# EAGLE schematic design1 (EAGLE 9.5.1)

## Sheet 1 of 2
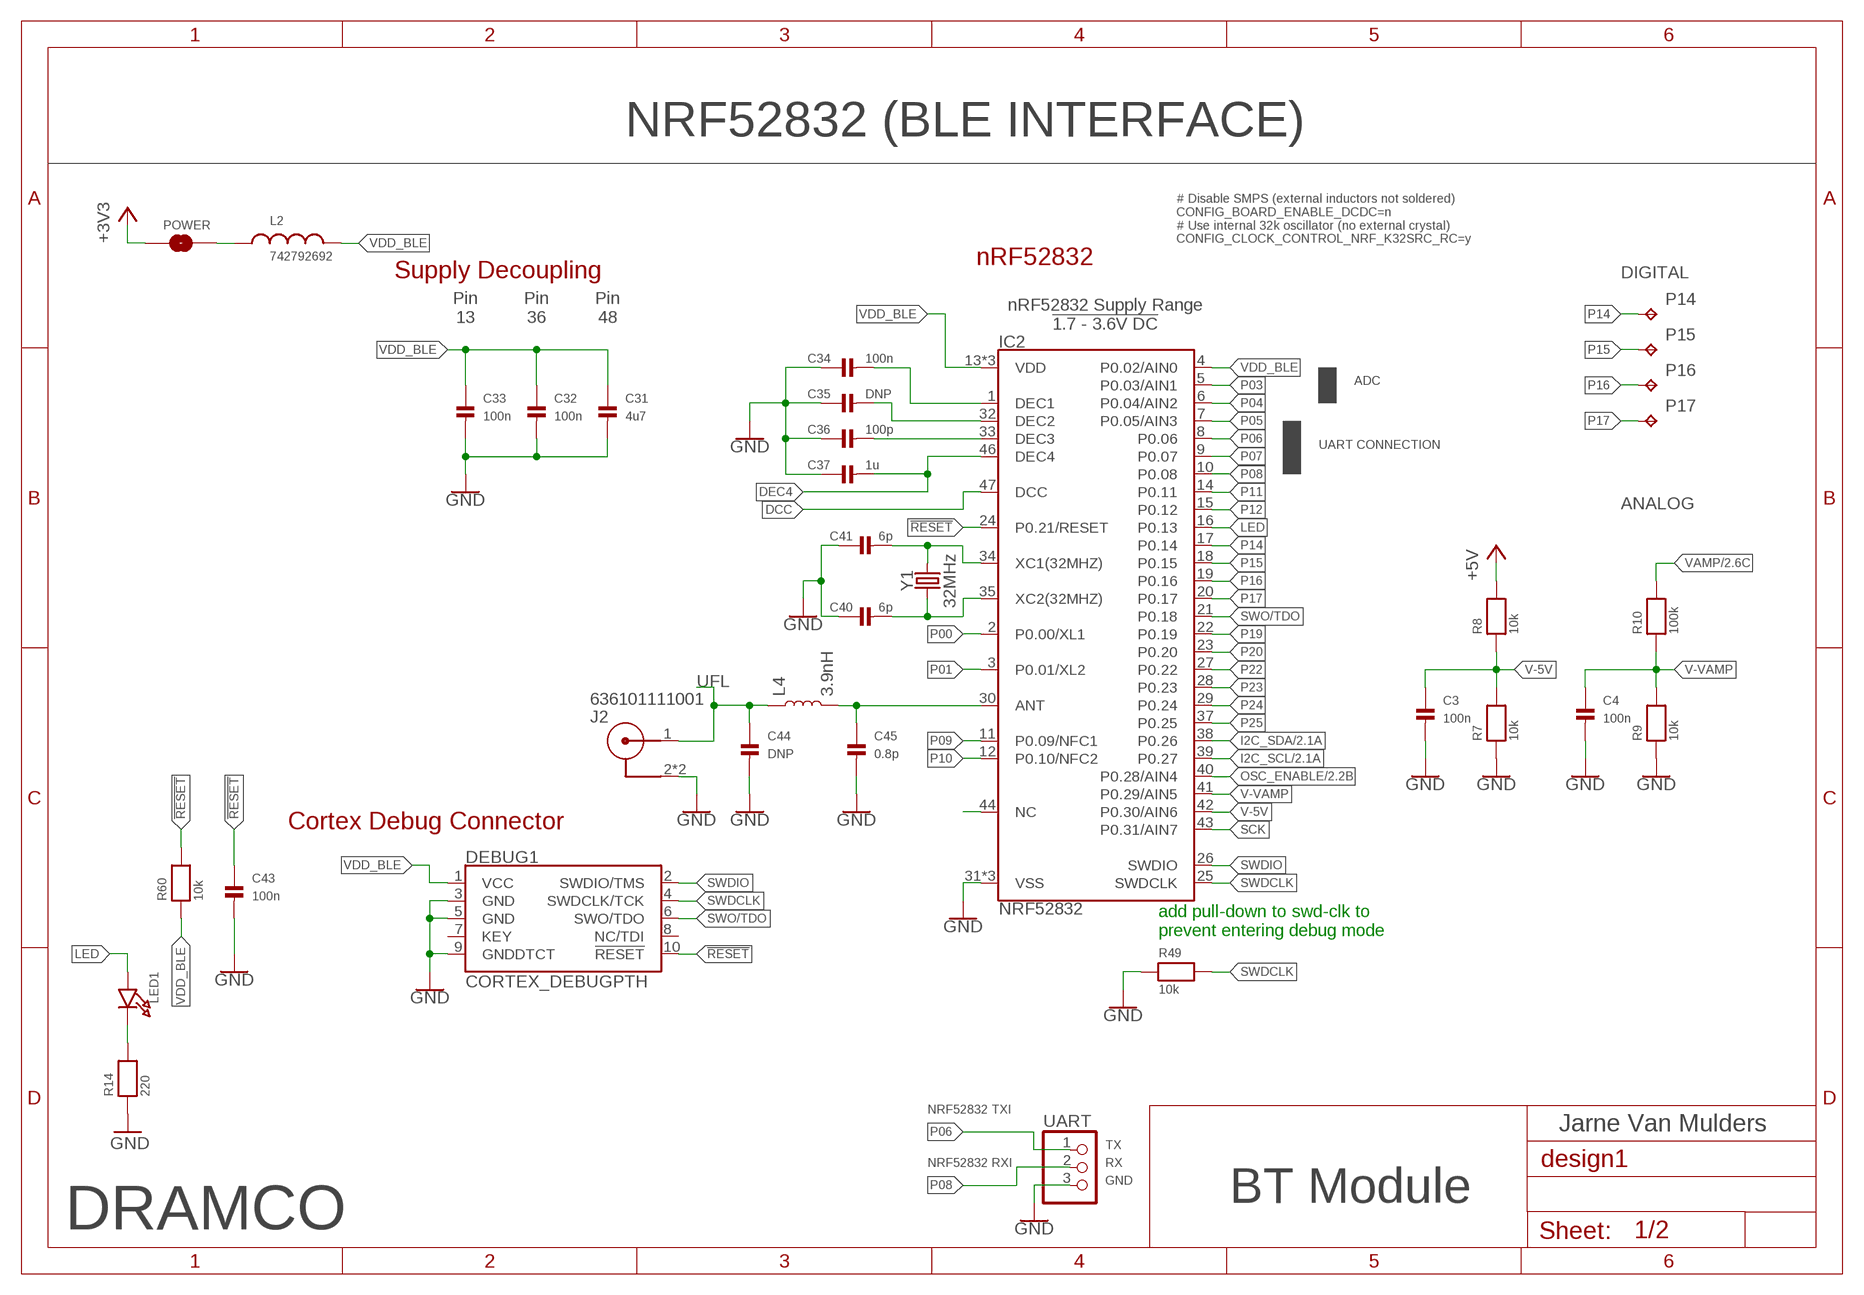
[diagram p0: schematic, sheet 1]

### Parts
C3  100n  CAP_CERAMIC0402  [0402]
C4  100n  CAP_CERAMIC0402  [0402]
C31  4u7  CAP_CERAMIC0603  [0603]
C32  100n  CAP_CERAMIC0402  [0402]
C33  100n  CAP_CERAMIC0402  [0402]
C34  100n  CAP_CERAMIC0402  [0402]
C35  DNP  CAP_CERAMIC0402  [0402]
C36  100p  CAP_CERAMIC0402  [0402]
C37  1u  CAP_CERAMIC0402  [0402]
C40  6p  CAP_CERAMIC0402  [0402]
C41  6p  CAP_CERAMIC0402  [0402]
C43  100n  CAP_CERAMIC0402  [0402]
C44  DNP  CAP_CERAMIC0402  [0402]
C45  0.8p  CAP_CERAMIC0402  [0402]
DEBUG1  CORTEX_DEBUGPTH  [2X5-PTH-1.27MM]
IC2  NRF52832  NRF52832-EXTENDED  [QFN48-6X6MM-EXTENDED]
J2  636101111001  [636101111001]
L2  742792692  WE-CBF_0603_742792692_WB_HS  [WE-CBF_0603(W=2.2)]
L4  3.9nH  INDUCTOR-0402-3.9NH  [0402]
LED1  LED0805  [CHIPLED_0805]
P14  TPTP10SQ  [TP10SQ]
P15  TPTP10SQ  [TP10SQ]
P16  TPTP10SQ  [TP10SQ]
P17  TPTP10SQ  [TP10SQ]
POWER  JUMPER-SMT_2_NO_NO-SILK  [SMT-JUMPER_2_NO_NO-SILK]
R7  10k  RESISTOR0402  [0402]
R8  10k  RESISTOR0402  [0402]
R9  10k  RESISTOR0402  [0402]
R10  100k  RESISTOR0402  [0402]
R14  220  RESISTOR0603  [0603]
R49  10k  RESISTOR0402  [0402]
R60  10k  RESISTOR0402  [0402]
UART  HEADER-1X3ROUND  [1X03_ROUND]
Y1  32MHz  CRYSTAL-32MHZ-SMD-2.0X1.6MM  [CRYSTAL-SMD-2.0X1.6MM]

### Nets
!RESET!: C43.1 DEBUG1.10(!RESET) IC2.24(P0.21/RESET) R60.2
+3V3: POWER.1 ; also sheet 2
+5V: R8.2 ; also sheet 2
ANT: C45.1 IC2.30(ANT) L4.2
DCC: IC2.47(DCC)
DEC4: C37.2 IC2.46(DEC4)
DEC5: C34.2 IC2.1(DEC1)
DEC6: C35.2 IC2.32(DEC2)
DEC8: C36.2 IC2.33(DEC3)
GND: C3.2 C4.2 C31.2 C32.2 C33.2 C34.1 C35.1 C36.1 C37.1 C40.1 C41.1 C43.2 C44.2 C45.2 DEBUG1.3(GND) DEBUG1.5(GND) DEBUG1.9(GNDDTCT) IC2.31(VSS) IC2.45(VSS) IC2.EP(VSS) J2.2 J2.3 R7.1 R9.1 R14.1 R49.1 UART.3 ; also sheet 2
I2C_SCL: IC2.39(P0.27) ; also sheet 2
I2C_SDA: IC2.38(P0.26) ; also sheet 2
LED: IC2.16(P0.13) LED1.A
N$5: LED1.C R14.2
N$14: L2.1 POWER.2
NC: IC2.44(NC)
OSC_ENABLE: IC2.40(P0.28/AIN4) ; also sheet 2
P00: IC2.2(P0.00/XL1)
P01: IC2.3(P0.01/XL2)
P03: IC2.5(P0.03/AIN1)
P04: IC2.6(P0.04/AIN2)
P05: IC2.7(P0.05/AIN3)
P06: IC2.8(P0.06) UART.1
P07: IC2.9(P0.07)
P08: IC2.10(P0.08) UART.2
P09: IC2.11(P0.09/NFC1)
P10: IC2.12(P0.10/NFC2)
P11: IC2.14(P0.11)
P12: IC2.15(P0.12)
P14: IC2.17(P0.14) P14.TP
P15: IC2.18(P0.15) P15.TP
P16: IC2.19(P0.16) P16.TP
P17: IC2.20(P0.17) P17.TP
P19: IC2.22(P0.19)
P20: IC2.23(P0.20)
P22: IC2.27(P0.22)
P23: IC2.28(P0.23)
P24: IC2.29(P0.24)
P25: IC2.37(P0.25)
SCK: IC2.43(P0.31/AIN7)
SWDCLK: DEBUG1.4(SWDCLK/TCK) IC2.25(SWDCLK) R49.2
SWDIO: DEBUG1.2(SWDIO/TMS) IC2.26(SWDIO)
SWO/TDO: DEBUG1.6(SWO/TDO) IC2.21(P0.18)
UFL: C44.1 J2.1 L4.1
V-5V: C3.1 IC2.42(P0.30/AIN6) R7.2 R8.1
V-VAMP: C4.1 IC2.41(P0.29/AIN5) R9.2 R10.1
VAMP: R10.2 ; also sheet 2
VDD_BLE: C31.1 C32.1 C33.1 DEBUG1.1(VCC) IC2.4(P0.02/AIN0) IC2.13(VDD) IC2.36(VDD) IC2.48(VDD) L2.2 R60.1
XC1: C41.2 IC2.34(XC1(32MHZ)) Y1.3
XC2: C40.2 IC2.35(XC2(32MHZ)) Y1.1
Unconnected: DEBUG1.7(KEY) DEBUG1.8(NC/TDI)

### Notes on the sheet
- NRF52832 (BLE INTERFACE)
- # Disable SMPS (external inductors not soldered)
  CONFIG_BOARD_ENABLE_DCDC=n
  # Use internal 32k oscillator (no external crystal)
  CONFIG_CLOCK_CONTROL_NRF_K32SRC_RC=y
- nRF52832
- Supply Decoupling | DIGITAL
- nRF52832 Supply Range
  !1.7 - 3.6V DC!
- Pin
  13
- Pin
  36
- Pin
  48
- ADC
- UART CONNECTION
- ANALOG
- Cortex Debug Connector
- add pull-down to swd-clk to 
  prevent entering debug mode
- NRF52832 TXI
- Jarne Van Mulders
- TX
- NRF52832 RXI | RX
- GND
- BT Module
- DRAMCO

## Sheet 2 of 2
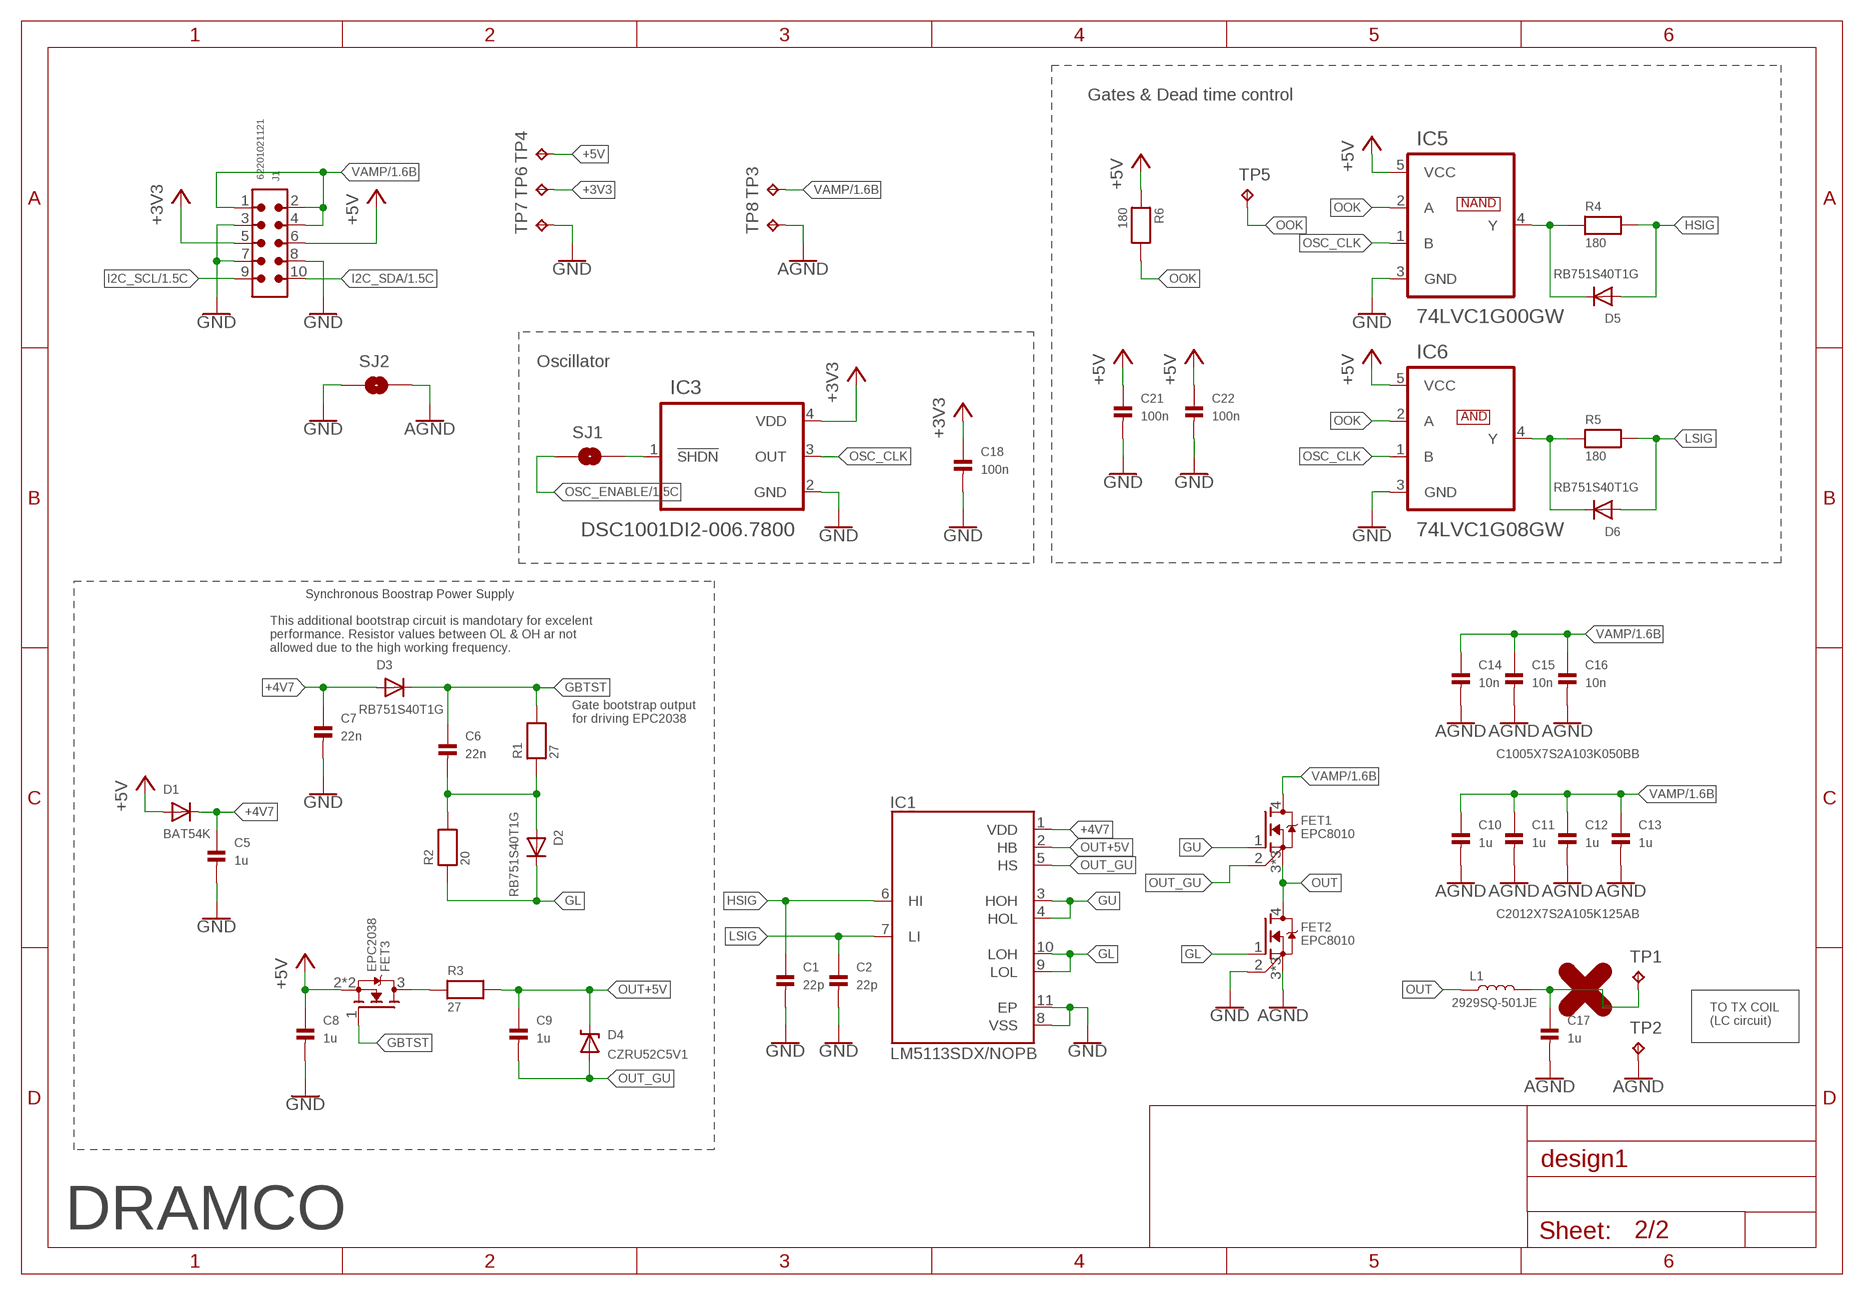
[diagram p1: schematic, sheet 2]

### Parts
C1  22p  CAP_CERAMIC0402  [0402]
C2  22p  CAP_CERAMIC0402  [0402]
C5  1u  CAP_CERAMIC0402  [0402]
C6  22n  CAP_CERAMIC0402  [0402]
C7  22n  CAP_CERAMIC0402  [0402]
C8  1u  CAP_CERAMIC0402  [0402]
C9  1u  CAP_CERAMIC0402  [0402]
C10  1u  CAP_CERAMIC0805  [0805]
C11  1u  CAP_CERAMIC0805  [0805]
C12  1u  CAP_CERAMIC0805  [0805]
C13  1u  CAP_CERAMIC0805  [0805]
C14  10n  CAP_CERAMIC0402  [0402]
C15  10n  CAP_CERAMIC0402  [0402]
C16  10n  CAP_CERAMIC0402  [0402]
C17  1u  CAP_CERAMIC0805  [0805]
C18  100n  CAP_CERAMIC0603  [0603]
C21  100n  CAP_CERAMIC0402  [0402]
C22  100n  CAP_CERAMIC0402  [0402]
D1  BAT54K  DIODESOD-523  [SOD-523]
D2  RB751S40T1G  DIODESOD-523  [SOD-523]
D3  RB751S40T1G  DIODESOD-523  [SOD-523]
D4  CZRU52C5V1  CZRU52  [SOD-523F]
D5  RB751S40T1G  DIODESOD-523  [SOD-523]
D6  RB751S40T1G  DIODESOD-523  [SOD-523]
FET1  EPC8010  [BGA-8010]
FET2  EPC8010  [BGA-8010]
FET3  EPC2038  [BGA-2038]
IC1  LM5113SDX/NOPB  [SON80P400X400X80-11N]
IC3  DSC1001DI2-006.7800  [2.5X2.0MMPLASTICPACKAGE]
IC5  74LVC1G00GW  [SOT65P210X110-5N]
IC6  74LVC1G08GW  74LVC1G00GW  [SOT65P210X110-5N]
J1  62201021121  6220XX21121_62201021121  [62201021121]
L1  2929SQ-501JE  2929SQ-501  [2929SQ-501]
R1  27  RESISTOR0402  [0402]
R2  20  RESISTOR0402  [0402]
R3  27  RESISTOR0402  [0402]
R4  180  RESISTOR0402  [0402]
R5  180  RESISTOR0402  [0402]
R6  180  RESISTOR0402  [0402]
SJ1  SOLDERJUMPERNO  [SJ_2S-NO]
SJ2  SOLDERJUMPERNO  [SJ_2S-NO]
TP1  TPTP20SQ  [TP20SQ]
TP2  TPTP20SQ  [TP20SQ]
TP3  TPTP20SQ  [TP20SQ]
TP4  TPTP10SQ  [TP10SQ]
TP5  TPTP10SQ  [TP10SQ]
TP6  TPTP10SQ  [TP10SQ]
TP7  TPTP10SQ  [TP10SQ]
TP8  TPTP20SQ  [TP20SQ]

### Nets
+3V3: C18.1 IC3.4(VDD) J1.5 TP6.TP ; also sheet 1
+4V7: C5.1 C7.1 D1.K(C) D3.A IC1.1(VDD)
+5V: C8.1 C21.1 C22.1 D1.A FET3.2(S) FET3.4(S) IC5.5(VCC) IC6.5(VCC) J1.6 R6.1 TP4.TP ; also sheet 1
AGND: C10.2 C11.2 C12.2 C13.2 C14.2 C15.2 C16.2 C17.2 FET2.3(S) FET2.5(S) FET2.6(S) SJ2.2 TP2.TP TP8.TP
GBTST: C6.1 D3.K(C) FET3.1(G) R1.2
GL: D2.K(C) FET2.1(G) IC1.9(LOL) IC1.10(LOH) R2.1
GND: C1.2 C2.2 C5.2 C7.2 C8.2 C18.2 C21.2 C22.2 FET2.2(SR) IC1.8(VSS) IC1.11(EP) IC3.2(GND) IC5.3(GND) IC6.3(GND) J1.3 J1.7 J1.8 SJ2.1 TP7.TP ; also sheet 1
GU: FET1.1(G) IC1.3(HOH) IC1.4(HOL)
HSIG: C1.1 D5.A IC1.6(HI) R4.2
I2C_SCL: J1.9 ; also sheet 1
I2C_SDA: J1.10 ; also sheet 1
LSIG: C2.1 D6.A IC1.7(LI) R5.2
N$1: FET3.3(D) R3.1
N$2: D5.K(C) IC5.4(Y) R4.1
N$3: IC3.1(!SHDN!) SJ1.2
N$4: D6.K(C) IC6.4(Y) R5.1
N$7: C6.2 D2.A R1.1 R2.2
N$8: C17.1 L1.2 TP1.TP
OOK: IC5.2(A) IC6.2(A) R6.2 TP5.TP
OSC_CLK: IC3.3(OUT) IC5.1(B) IC6.1(B)
OSC_ENABLE: SJ1.1 ; also sheet 1
OUT: FET1.3(S) FET1.5(S) FET1.6(S) FET2.4(D) L1.1
OUT+5V: C9.1 D4.1(C) IC1.2(HB) R3.2
OUT_GU: C9.2 D4.2(A) FET1.2(SR) IC1.5(HS)
VAMP: C10.1 C11.1 C12.1 C13.1 C14.1 C15.1 C16.1 FET1.4(D) J1.1 J1.2 J1.4 TP3.TP ; also sheet 1

### Notes on the sheet
- Gates & Dead time control
- NAND
- Oscillator
- AND
- Synchronous Boostrap Power Supply
- This additional bootstrap circuit is mandotary for excelent
  performance. Resistor values between OL & OH ar not 
  allowed due to the high working frequency.
- Gate bootstrap output 
  for driving EPC2038
- C1005X7S2A103K050BB
- C2012X7S2A105K125AB
- TO TX COIL
  (LC circuit)
- DRAMCO

## Library data of the parts
C1-C18 C21 C22 C31-C37 C40 C41 C43-C45 = microbuilder:CAP_CERAMIC: Ceramic Capacitors 0402 - 0402 Surface Mount Capacitors 16pF 50V 5% [Digikey: 445-4899-2-ND] 18pF 50V 5% [Digikey: 490-1281-2-ND] 22pF 50V 5% [Digikey: 490-1283-2-ND] 68pF 50V 5% [Digikey: 490-1289-2-ND] 0.1uF 10V 10% [Digikey: 490-1318-2-ND] 1.0uF 6.3V 10% [Digikey: 490-1320-2-ND] 0603 - 0603 Surface Mount Capacitors 16 pF 50V 5% [Digikey: 445-5051-2-ND] 22 pF 50V [Digikey: PCC220ACVTR-ND] 33 pF 50V 5% [Digikey: 490-1415-1-ND] 56pF 50V 5% [Digikey: 490-1421-1-ND] 220pF 50V 5% [Digikey: 445-1285-1-ND] 680 pF 50V 2200 pF 50V 5% C0G [Digikey: 445-1297-1-ND] 5600 pF 100V 5% X7R [Digikey: 478-3711-1-ND] 0.1 µF 25V 10% [Digikey: PCC2277TR-ND] 0.22 µF 16V 10% X7R [Digikey: 445-1318-1-ND] 1.0 µF 25V 10% [Digikey: 445-5146-2-ND] 0603 - RF Specific 3pF 250V +/-0.1pF RF [Digikey: 712-1347-1-ND] 18 pF 250V 5% [Digikey: 478-3505-1-ND or 712-1322-1-ND] 56 pF 250V 5% C0G RF [Digikey: 490-4867-1-ND] 68 pF 250V RF [Digikey: 490-4868-1-ND] 0805 - 0805 Surface Mount Capacitors 220 pF 250V 2% RF Ceramic Capacitor [Digikey: 712-1398-1-ND] 1000 pF 50V 2% NP0 Ceramic Capacitor [Digikey: 478-3760-1-ND] 0.1 µF 25V 10% Ceramic Capacitor [Digikey: PCC1828TR-ND] 1.0 µF 16V 10% Ceramic Capacitor[Digikey: 490-1691-2-ND] 10.0 µF 10V 10% Ceramic Capacitor[Digikey: 709-1228-1-ND] 10.0 uF 16V 10% Ceramic Capacitor [Digikey: 478-5165-2-ND] 47 uF 6.3V 20% Ceramic Capacitor [Digikey: 587-1779-1-ND or 399-5506-1-ND] 1206 - 1206 Surface Mount Capacitors 47uF 10V 20% Ceramic Capacitor [Digikey: 490-5528-1-ND or 399-5508-1-ND or 445-6010-1-ND] 100uF 6.3V -20%, +80% Y5V Ceramic Capacitor (Digikey: 490-4512-1-ND, Mouser: 81-GRM31CF50J107ZE1L)
D1-D3 D5 D6 = microbuilder:DIODE: Diode SMA Model Volts Amps Type Vf Vr Digikey # Notes SSA34-E3 40V 3A Schottky 480mV @ 3A 200uA @ 40V SSA34-E3/61TGITR-ND CDBA120-G 20V 1A Schottky 500mV @ 1A 500uA @ 20V 641-1014-6-ND REEL MBRA210 10V 2A Schottky 350mV @ 2A 700uA @ 10V MBRA210LT3 SOD-123 Model Volts Amps Type Vf Vr Order # Notes BAT54T1G 30V 200mA Schottky 800mV @ 200mA 2uA @ 25V BAT54T1GOSTR-ND B0530W 30V 500mA Schottky 430mV @ 500mA 130uA @ 30V B0530W-FDICT-ND REEL MBR120 1A 20V Schottky 340mV @ 1A MBR120VLSFT1GOSCT-ND SOD-323 Model Volts Amps Type Vf Vr Order # Notes PMEG2005EJ 20V 500mA Schottky 355mV @ 500mA 568-4110-1-ND ZLLS410 10V 570mA Schottky 380mV @ 570mA ZLLS410CT-ND 1N4148WS 75V 150mA Silicon/Simple 1V 1N4148WSFSCT-ND REEL SOD-523 Model Volts Amps Type Vf Vr Order # Notes BAT54XV2 30V 200mA Schottky 0.8V @ 100mA BAT54XV2CT-ND TB751S 30V 30mA Schottky RB751S-40TE61CT-ND SOT23-R/W (R = Solder Paste/Reflow Ovens, W = Hand-Soldering) Model Volts Amps Type Vf Vr Order # Notes BAT54FILM 40V 300mA Schottky 497-7162-1-ND
D4 = microbuilder:CZRU52
DEBUG1 = SparkFun-Connectors:CORTEX_DEBUG: Cortex Debug Connector Datasheet <http://infocenter.arm.com/help/topic/com.arm.doc.faqs/attached/13634/cortex_debug_connectors.pdf>
FET1 FET2 = EPC-MOS:EPC8010
FET3 = EPC-MOS:EPC2038
IC1 = LM5113SDX_NOPB:LM5113SDX/NOPB: 5A, 100V Half-Bridge Gate Driver for Enhancement Mode GaN FETs 10-WSON -40 to 125 Check availability <https://pricing.snapeda.com/parts/LM5113SDX/NOPB/Texas%20Instruments/view-part?ref=eda>; AVAILABILITY: In Stock; DESCRIPTION: 1.2-A/5-A, 100-V half bridge gate driver for GaNFET 10-WSON -40 to 125; MF: Texas Instruments; MP: LM5113SDX/NOPB; PACKAGE: WSON-10 Texas Instruments; PRICE: None; PURCHASE-URL: https://pricing.snapeda.com/search?q=LM5113SDX/NOPB&ref=eda
IC2 = SparkFun-RF:NRF52832-EXTENDED
IC3 = DSC1001:DSC1001DI2-006.7800: None Check availability <https://pricing.snapeda.com/parts/DSC1001DI1-025.0000/Microchip/view-part?ref=eda>; AVAILABILITY: In Stock; DESCRIPTION: 25 MHz XO (Standard) CMOS Oscillator 1.8V ~ 3.3V Standby (Power Down) 4-SMD, No Lead; MF: Microchip; MP: DSC1001DI1-025.0000; PACKAGE: SMD-4 Microchip; PRICE: None; PURCHASE-URL: https://pricing.snapeda.com/search?q=DSC1001DI1-025.0000&ref=eda
IC5 IC6 = 74LVC1G00GW:74LVC1G00GW: Single 2-input NAND gate Check availability <https://pricing.snapeda.com/parts/74LVC1G00GW/Nexperia%20USA/view-part?ref=eda>; AVAILABILITY: In Stock; DESCRIPTION: NAND Gate IC 1 Channel - 5-TSSOP; MF: Nexperia USA; MP: 74LVC1G00GW; PACKAGE: TSSOP-5 Nexperia USA; PRICE: None; PURCHASE-URL: https://pricing.snapeda.com/search?q=74LVC1G00GW&ref=eda
J1 = Eagle_WR-PHD (rev22a):6220XX21121_62201021121: WR-PHD 1.27 mm THT Dual Pin Header ARTICLE PROPERTIES: Pins:4;​ 8;​ 10;​ 14;​ 16;​ 20;​ 28 KIND PROPERTIES: Pitch：1.27 mm Quality Class:3 as per CECC 75 301-802 Rows：Dual Gender：Pin Header Type：Straight MATERIAL PROPERTIES: Insulator Material :PA9T Insulator Flammability Rating:UL94 V-0 Contact Material:Copper Alloy Contact Plating:Gold Contact Type:Stamped GENERAL INFORMATION Operating Temperature:-40 up to +105 °C Compliance:Lead free / RoHS ELECTRICAL PROPERTIES: Rated Current:1 A;​ max. IR1:1 A Withstanding Voltage:500 V (AC) Contact Resistance:20 mΩ RISO:1000 MΩ CERTIFICATION UL Approval:E323964 PACKAGING PROPERTIES Packaging:Box Packaging Unit:1000;​ 800;​ 500;​ 200 <https://katalog.we-online.com/media/images/v2/o33223v209%20Family_WR-PHD_6220xx21121.jpg> Details see: https://katalog.we-online.com/en/em/PHD_1_27_THT_DUAL_PIN_HEADER_6220XX21121 Updated by Yingchun,Shan 2019-10-25 2019 (C) Würth Elektronik; DATASHEET-URL: https://www.we-online.com/redexpert/spec/62201021121?ae; GENDER: Pin Header; IR: 1A; MOUNT: THT; PACKAGING: Box; PART-NUMBER: 62201021121; PINS: 10; PITCH: 1.27mm; ROWS: Dual; TYPE: Straight
J2 = Eagle_WR-UMRF (rev21b):636101111001: WR-UMRF PCB Receptacle SMT with 3 Pads MATERIAL PROPERTIES Insulator Material LCP Insulator Color Natural Insulator Flammability Rating UL94 V-0 Center Contact Material Brass Center Contact Plating Gold over Nickel GENERAL INFORMATION Operating Temperature -40 up to +90 °C <https://www.we-online.com/katalog/media/o325314v209%20Single_WR-UMRF_63610111x001.jpg> Details see: https://www.we-online.com/katalog/en/PCB_RECECTACLE_SMT_WITH_3_PADS Updated by Ella Wu 2021-07-20 2021(C) Würth Elektronik; DATASHEET-URL: https://www.we-online.com/catalog/datasheet/636101111001.pdf; GENDER: PCB Receptacle; MOUNT: SMT; PART-NUMBER: 636101111001; Z: 50Ohm
L1 = 2929SQ:2929SQ-501
L2 = PowerMagnetics (rev18e):WE-CBF_0603: WE-CBF SMD EMI Suppression Ferrite Bead Characteristics Reliable Ni-Sn electrodes High rated current up to 6 A Operating temperature: –55 ºC to +125 ºC Applications Perfect as data lined filter and for uncoupling of distribution voltage Variant abbreviation WB means WIDE BAND HS means HIGH SPEED HC means HIGH CURRENT <http://katalog.we-online.de/media/images/v2/Family_WE-CBF.jpg> Details see: http://katalog.we-online.de/en/pbs/WE-CBF Updated on 2014-06-19 2014 (C) Wurth Elektronik; WE-NUMBER: 742792692/1800Ω(Z@100MHz)
L4 = nrf52832-breakout-temp:INDUCTOR: Inductors Resist changes in electrical current. Basically a coil of wire. SparkFun Products: SparkFun Load Cell Amplifier - HX711 <https://www.sparkfun.com/products/13879> IOIO-OTG - V2.2 <https://www.sparkfun.com/products/13613>; PROD_ID: NDUC-13457
LED1 = microbuilder:LED: LED 0603 - 0603 Surface Mount Package 2mA: Green LED - Low Power (3.9mcd, 2ma, 1.7Vf) - Digikey: 475-2709-2-ND Orange LED - Low Power (9.8mcd, 2ma, 1.8Vf) - Digikey: 475-1194-2-ND Red LED - Low Power (5mcd, 2ma, 1.8Vf) - Digikey: 475-1195-2-ND Yellow LED - Low Power (7mcd, 2ma, 1.8Vf) - Digikey: 475-1196-2-ND 5mA: Blue LED - Low Power (17mcd, 5ma, 2.9Vf) - Digikey: LNJ937W8CRACT-ND 0805 - 0805 Surface Mount Package 2mA: Red LED (8.8mcd, 2mA, 1.8Vf, Clear) - Low Power [Digikey: 475-2510-1-ND] Green LED (5mcd, 2mA, 1.8Vf, Clear) - Low Power [Digikey: 475-2730-1-ND] Yellow LED (11.3mcd, 2mA, 1.8Vf, Clear) - Low Power [Digikey: 475-2555-1-ND] 20mA: Red LED (104mcd, 20mA, Diffused) - LS R976 [Digikey: 475-1278-6-ND] Red LED (12mcd, 20mA, 2.0Vf, Clear) - APT2012EC [Digikey: 754-1128-1-ND] Green LED (15mcd, 20mA, 2.2Vf, Clear) - APT2012GC [Digikey: 754-1131-1-ND] Orange LED (160mcd, 20mA, 2.1Vf, Clear) - APT2012SECK [Digikey: 754-1130-1-ND] 1206 - 1206 Surface Mount Package Green LED (26mcd, 20mA, Diffused) - LG N971 [Digikey: 475-1407-6-ND] Red LED (15mcd, 20mA, Diffused) - LH N974 [Digikey: 475-1416-6-ND]
P14-P17 TP1-TP8 = testpad:TP: Test pad
POWER = SparkFun-Jumpers:JUMPER-SMT_2_NO: Normally open jumper This jumper has two pads in close proximity to each other. Apply solder to close the connection. Round pads are easier to solder for beginners, but are a lot larger. SparkFun Product that uses the round pads: SparkFun EL Sequencer <https://www.sparkfun.com/products/12781>
R1-R10 R14 R49 R60 = microbuilder:RESISTOR: Resistors 0402 - 0402 Surface Mount Package 22 Ohm 1% 1/16W [Digikey: 311-22.0LRTR-ND] 33 Ohm 5% 1/16W 1.0K 5% 1/16W 1.5K 5% 1/16W 2.0K 1% 1/16W 10.0K 1% 1/16W [Digikey: 311-10.0KLRTR-ND] 10.0K 5% 1/16W [Digikey: RMCF0402JT10K0TR-ND] 12.1K 1% 1/16W [Digikey: 311-22.0LRTR-ND] 100.0K 5% 1/16W 0603 - 0603 Surface Mount Package 0 Ohm 1/10 Watt 1% Resistor 15 Ohm 1/10 Watt 1% Resistor 33 Ohm 1/10 Watt 1% Resistor 49.9 Ohm 1/10 Watt 1% Resistor 100 Ohm 1/10 Watt 1% Resistor 150 Ohm 1/10 Watt 1% Resistor 240 Ohm 1/10 Watt 1% Resistor 390 Ohm 1/10 Watt 1% Resistor 560 Ohm 1/10 Watt 1% Resistor 680 Ohm 1/10 Watt 1% Resistor 750 Ohm 1/10 Watt 1% Resistor 1.0K Ohm 1/10 Watt 1% Resistor 1.5K Ohm 1/10 Watt 1% Resistor 2.0K Ohm 1/10 Watt 1% Resistor 2.2K Ohm 1/10 Watt 1% Resistor 3.3K Ohm 1/10 Watt 1% Resistor 4.7K Ohm 1/10 Watt 1% Resistor 10.0K Ohm 1/10 Watt 1% Resistor 12.0K Ohm 1/10 Watt 1% Resistor 12.1K Ohm 1/10 Watt 1% Resistor 20.0K Ohm 1/10 Watt 1% Resistor 33.0K Ohm 1/10 Watt 1% Resistor 100.0K Ohm 1/10 Watt 1% Resistor 0805 - 0805 Surface Mount Package 0 Ohm 1/8 Watt 1% Resistor 33 Ohm 1/8 Watt 1% Resistor 100 Ohm 1/8 Watt 1% Resistor 150 Ohm 1/8 Watt 1% Resistor 200 Ohm 1/8 Watt 1% Resistor 240 Ohm 1/8 Watt 1% Resistor 330 Ohm 1/8 Watt 1% Resistor 390 Ohm 1/8 Watt 1% Resistor 470 Ohm 1/8 Watt 1% Resistor 1.0K Ohm 1/8 Watt 1% Resistor 1.5K Ohm 1/8 Watt 1% Resistor 2.0K Ohm 1/8 Watt 1% Resistor 4.7K Ohm 1/8 Watt 1% Resistor 5.1K Ohm 1/8 Watt 1% Resistor 5.6K Ohm 1/8 Watt 1% Resistor 10.0K Ohm 1/8 Watt 1% Resistor 22.0K Ohm 1/8 Watt 1% Resistor 33.0K Ohm 1/8 Watt 1% Resistor 100K Ohm 1/8 Watt 1% Resistor 1206 - 1206 Surface Mount Package 2012 - 2010 Surface Mount Package 0.11 Ohm 1/2 Watt 1% Resistor - Digikey: RHM.11UCT-ND
SJ1 SJ2 = SparkFun-Retired:SOLDERJUMPER: Solder Jumper Standard SMD solder jumper. Used to automate production. Two varients : Normally Open and Normally Closed are the same, but have different paste layers. NC will have a large amount of paste and should jumper during reflow.
UART = microbuilder:HEADER-1X3: PIN HEADER
Y1 = nrf52832-breakout-temp:CRYSTAL-32MHZ: 32MHz Crystal Digikey Example <http://www.digikey.com/product-detail/en/murata-electronics-north-america/XRCGB32M000F2P00R0/490-9769-1-ND/4952013> Frequency: 32MHz Frequency Stability: ±20ppm Frequency Tolerance: ±20ppm Load Capacitance: 6pF; PROD_ID: XTAL-13459